# EAGLE design camera2 (EAGLE 6.4)
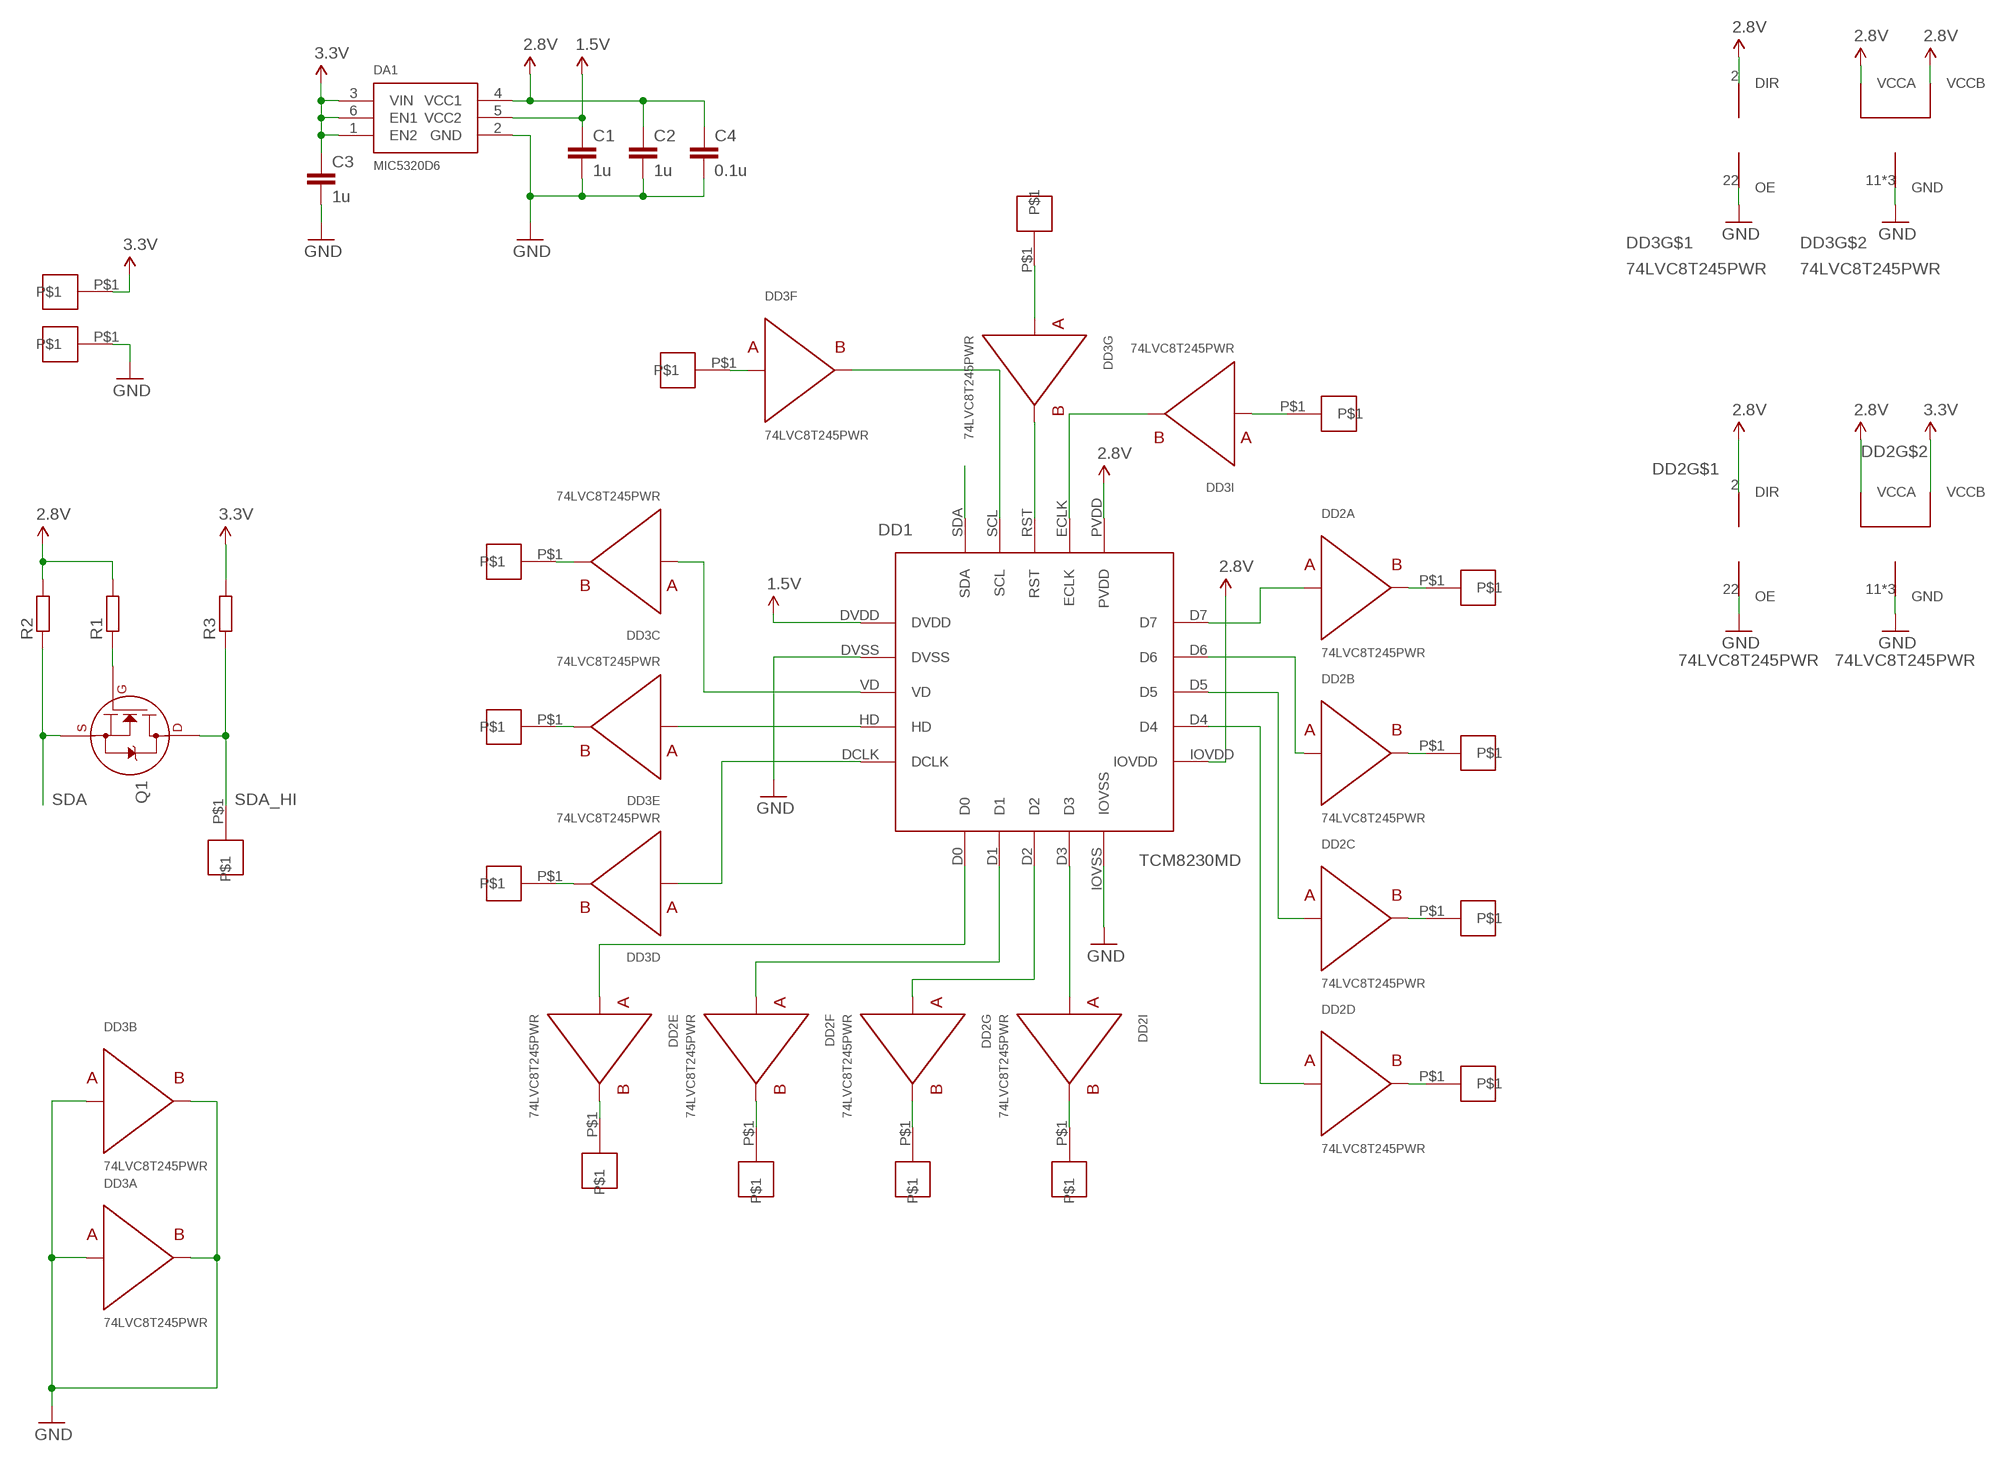
[diagram p0: schematic, sheet 1]

## Parts
C1  1u  C-EUC0603  [C0603]
C2  1u  C-EUC0603  [C0603]
C3  1u  C-EUC0603  [C0603]
C4  0.1u  C-EUC0603  [C0603]
DA1  MIC5320D6  [SOT23-6]
DD1  TCM8230MD  [TCM8230MD]
DD2  74LVC8T245PWR  [TSSOP24]
DD3  74LVC8T245PWR  [TSSOP24]
GND  HOLE  [HOLE]
Q1  2N7000_SOT23  [SOT-23]
R1  R-EU_R0603  [R0603]
R2  R-EU_R0603  [R0603]
R3  R-EU_R0603  [R0603]
SDAC  HOLE  [HOLE]
SDLC  HOLE  [HOLE]
U$27  HOLE  [HOLE]
U$30  HOLE  [HOLE]
U$31  HOLE  [HOLE]
U$32  HOLE  [HOLE]
U$33  HOLE  [HOLE]
U$34  HOLE  [HOLE]
U$35  HOLE  [HOLE]
U$36  HOLE  [HOLE]
U$37  HOLE  [HOLE]
U$38  HOLE  [HOLE]
U$39  HOLE  [HOLE]
U$40  HOLE  [HOLE]
U$41  HOLE  [HOLE]
VDD  HOLE  [HOLE]

## Nets
1.5V: C1.1 DA1.5(VCC2) DD1.DVDD
2.8V: C2.1 C4.1 DA1.4(VCC1) DD1.IOVDD DD1.PVDD DD2.1(VCCA) DD2.2(DIR) DD3.1(VCCA) DD3.2(DIR) DD3.23(VCCB) DD3.24(VCCB) R1.2 R2.2
3.3V: C3.1 DA1.1(EN2) DA1.3(VIN) DA1.6(EN1) DD2.23(VCCB) DD2.24(VCCB) R3.2 VDD.P$1
D0_O: DD2.17(E:B1) U$32.P$1
D1_O: DD2.16(F:B1) U$31.P$1
D2_O: DD2.15(G:B1) U$30.P$1
D3_O: DD2.14(I:B1) U$27.P$1
D4_O: DD2.18(D:B1) U$36.P$1
D5_O: DD2.19(C:B1) U$35.P$1
D6_O: DD2.20(B:B1) U$34.P$1
D7_O: DD2.21(A:B1) U$33.P$1
DCLK_O: DD3.18(D:B1) U$39.P$1
ECLK: DD1.ECLK DD3.14(I:B1)
ECLK_O: DD3.10(I:A1) U$41.P$1
GND: C1.2 C2.2 C3.2 C4.2 DA1.2(GND) DD1.DVSS DD1.IOVSS DD2.11(GND) DD2.12(GND) DD2.13(GND) DD2.22(OE) DD3.3(A:A1) DD3.4(B:A1) DD3.11(GND) DD3.12(GND) DD3.13(GND) DD3.20(B:B1) DD3.21(A:B1) DD3.22(OE) GND.P$1
HD_O: DD3.17(E:B1) U$38.P$1
N$1: DD1.D3 DD2.10(I:A1)
N$2: DD1.D7 DD2.3(A:A1)
N$3: DD1.D6 DD2.4(B:A1)
N$4: DD1.D5 DD2.5(C:A1)
N$5: DD1.D4 DD2.6(D:A1)
N$6: DD1.D0 DD2.7(E:A1)
N$7: DD1.D2 DD2.9(G:A1)
N$9: DD1.D1 DD2.8(F:A1)
N$10: DD1.VD DD3.5(C:A1)
N$11: DD1.HD DD3.7(E:A1)
N$12: Q1.1(G) R1.1
N$13: DD1.DCLK DD3.6(D:A1)
N$18: DD1.RST DD3.15(G:B1)
RST_O: DD3.9(G:A1) U$40.P$1
SDA: DD1.SDA Q1.2(S) R2.1
SDA_HI: Q1.3(D) R3.1 SDAC.P$1
SDL: DD1.SCL DD3.16(F:B1)
SDL_IN: DD3.8(F:A1) SDLC.P$1
VD_O: DD3.19(C:B1) U$37.P$1

## Library data of the parts
C1-C4 = rcl:C-EU: CAPACITOR, European symbol
DA1 = ezlib:MIC5320: Dual ULDO from MICREL
DD1 = ezlib:TCM8230: The TCM8230MD(A) is a camera module which includes area color image sensor embedded with camera signal processor that meets with VGA format. In the sensor area 492 vertical and 660 horizontal signal pixels, and the image size meets with 1/6 inch optical Format. Use of the CMOS process enables low power consumption operations. It also provides excellent color reproduction through its primary color filter, and embedded camera signal processor enables small and simple camera system. And this module can be assembled by the socket which is suitable for the reflow soldering. So it is fit to use as an image input device for digital still cameras, PC cameras and mobile devices.
DD2 DD3 = ezlib:74LVC8T245
GND SDAC SDLC U$27 U$30-U$41 VDD = ezlib:HOLE
Q1 = transistors:2N700*: 2N7000, 2N7002, NDS7002A N-channel enhancement mode MOSFET
R1-R3 = rcl:R-EU_: RESISTOR, European symbol

## Board
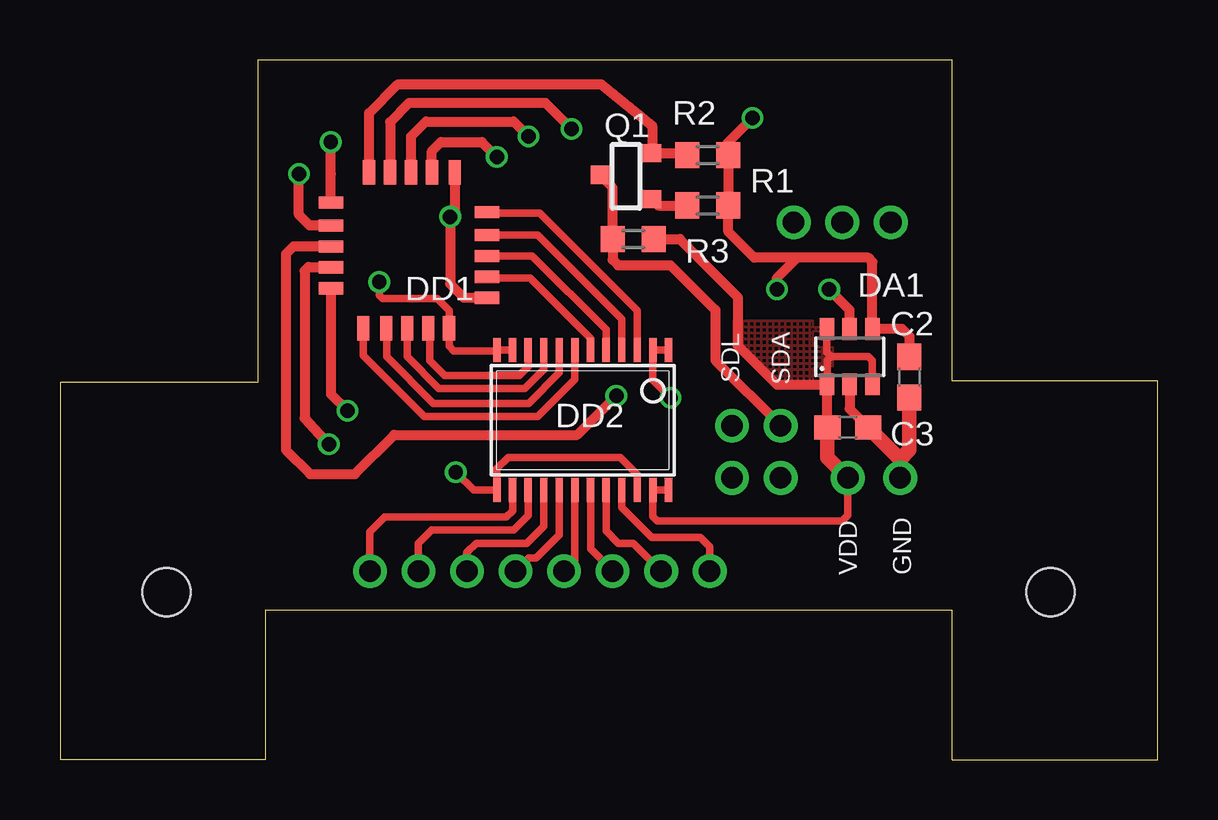
[diagram p1: board, top side]
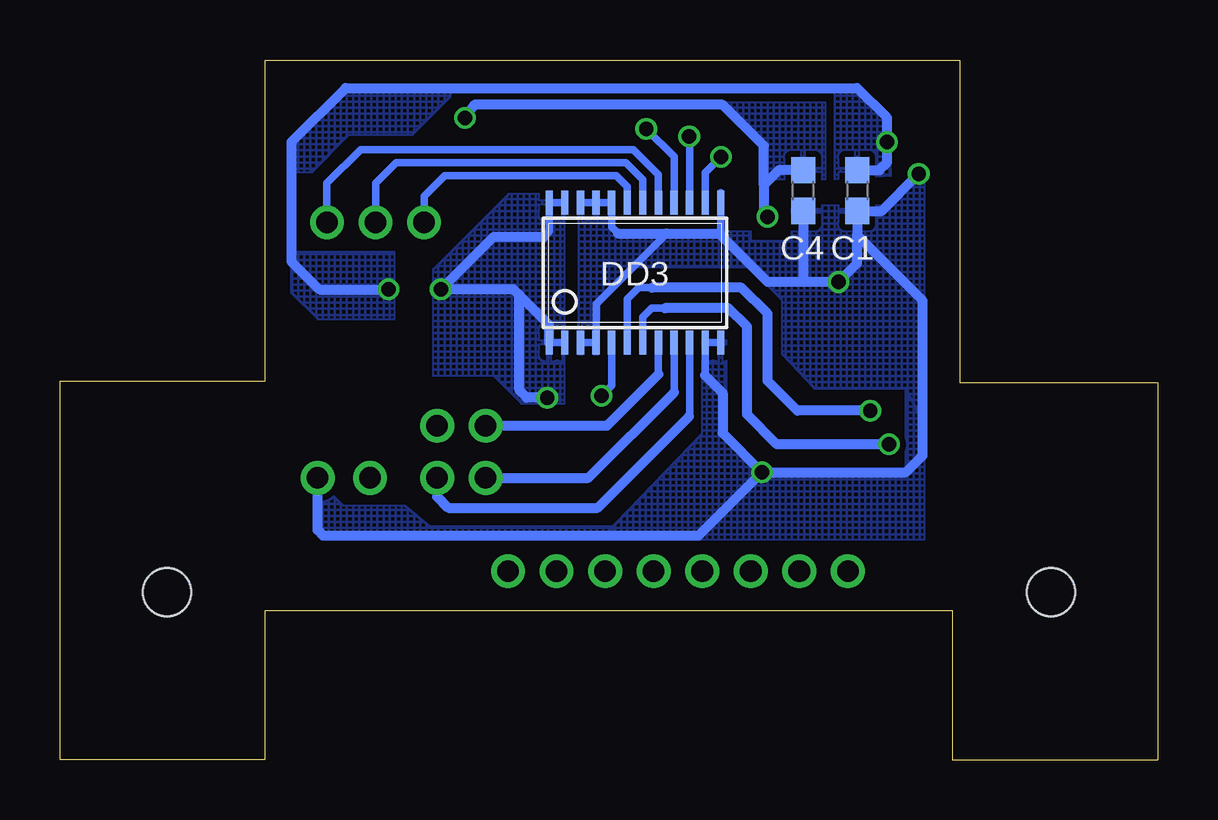
[diagram p2: board, bottom side, seen from below]

Size 45.74 x 29.17 mm. Coordinates in mm from the lower left corner, seen from the top.
Outline: 0,15.71 0,0 8.56,0 8.56,6.22 37.18,6.22 37.18,0 45.74,0 45.74,15.79 37.18,15.79 37.18,29.17 8.24,29.17 8.24,15.71 0,15.71
Copper layers (1*16): Top 0.035mm / dielectric 1.5mm / Bottom 0.035mm
Design rules "Fusion_eagle_rule_v1.1": minimum track width 6mil, minimum drill 12mil, track to track 6mil, track to pad 6mil, pad to pad 6mil, via to via 6mil, smd to smd 0mil, copper to edge 10mil, drill to drill 10mil, minimum pad ring 10mil, minimum via ring 6mil, stop-mask expansion 2mil, vias tented up to drill 100mil, thermal gap 10mil
Holes 2 mm at 4.45,6.99 41.27,6.99

### Footprints (pad centres in the part's own frame; a part is rotated, then mirrored left to right if it is on the bottom)
C0603 = smd 1.1 x 1: 1 -0.85,0; 2 0.85,0
SOT23-6 = smd 0.6 x 0.9: 1 -0.95,-1.15; 2 0,-1.15; 3 0.95,-1.15; 4 0.95,1.15; 5 0,1.15; 6 -0.95,1.15
TCM8230MD = smd 0.508 x 1.016: D0 -1.984,-3.254; D1 -1.032,-3.254; D2 -0.159,-3.254; D3 0.714,-3.254; ECLK 0.873,3.254; IOVSS 1.587,-3.254; PVDD 1.826,3.254; RST 0,3.254; SCL -0.873,3.254; SDA -1.746,3.254 | smd 1.016 x 0.508: D4 3.175,-1.111; D5 3.175,-0.238; D6 3.175,0.635; D7 3.175,1.587; DCLK -3.334,-1.587; DVDD -3.334,1.984; DVSS -3.334,1.032; HD -3.334,-0.714; IOVDD 3.175,-1.984; VD -3.334,0.159
TSSOP24 = smd 0.305 x 0.991: 1 -3.575,-2.918; 2 -2.925,-2.918; 3 -2.275,-2.918; 4 -1.625,-2.918; 5 -0.975,-2.918; 6 -0.325,-2.918; 7 0.325,-2.918; 8 0.975,-2.918; 9 1.625,-2.918; 10 2.275,-2.918; 11 2.925,-2.918; 12 3.575,-2.918; 13 3.575,2.918; 14 2.925,2.918; 15 2.275,2.918; 16 1.625,2.918; 17 0.975,2.918; 18 0.325,2.918; 19 -0.325,2.918; 20 -0.975,2.918; 21 -1.625,2.918; 22 -2.275,2.918; 23 -2.925,2.918; 24 -3.575,2.918
HOLE = drill 0.9: P$1 0,0
SOT-23 = smd 0.762 x 0.762: 1 -0.979,-1.101; 2 0.94,-1.101; 3 0.025,1.067
R0603 = smd 1 x 1.1: 1 -0.85,0; 2 0.85,0

### Placement (x,y rotation side)
C1  12.52,23.73 270 bottom
C2  35.39,15.95 270 top
C3  32.83,13.85 0 top
C4  14.78,23.73 270 bottom
DA1  32.9,16.8 0 top
DD1  14.62,21.24 0 top
DD2  21.78,14.16 180 top
DD3  21.78,20.3 0 bottom
GND  35,11.75 0 top
Q1  23.57,24.35 90 top
R1  26.99,23.1 0 top
R2  26.99,25.2 0 top
R3  23.88,21.7 0 top
SDAC  30.03,13.92 0 top
SDLC  28,13.92 0 top
U$27  12.91,7.86 270 top
U$30  14.94,7.86 270 top
U$31  16.96,7.86 90 top
U$32  18.98,7.86 90 top
U$33  27.07,7.86 270 top
U$34  25.05,7.86 270 top
U$35  23.03,7.86 270 top
U$36  21,7.86 270 top
U$37  30.57,22.4 0 top
U$38  34.62,22.4 0 top
U$39  32.59,22.4 0 top
U$40  28,11.75 0 top
U$41  30.03,11.75 0 top
VDD  32.83,11.75 0 top

### Tracks (layer width: path | path; a pad name or v marks a point on that pad's centre or on a via)
1.5V  (via drill 0.6)
  Top 0.406: DD1.DVDD 11.29,24.41 v11.28,25.75 | DA1.5 32.9,18.75 v32.05,19.6
  Bottom 0.406: v32.05,19.6 34.93,19.6 36.09,20.77 36.09,25.75 33.84,28 12.52,28 11.28,26.76 v11.28,25.75 11.28,24.89 11.6,24.57 C1.1
  pour Bottom (isolate 0.254, hatched): 31.82,21.16 36.09,21.16 36.09,19.45 35,18.36 31.82,18.36
  pour Bottom (isolate 0.254, hatched): 29.48,28 33.99,28 36.17,25.83 36.17,24.5 35.24,24.5 33.68,26.06 31.04,26.06 29.48,27.61
  pour Bottom (isolate 0.254, hatched): 13.46,24.19 11.12,24.35 11.2,26.76 12.45,28 13.46,28
2.8V  (via drill 0.6)
  Top 0.305: DD2.1 DD2.2 24.71,15.82 v25.44,15.09
  Top 0.406: 16.49,24.45 DD1.PVDD 16.45,22.83 v16.26,22.64 16.26,19.84 16.84,19.25 DD1.IOVDD | C2.1 35.39,17.66 35.08,17.97 33.87,17.97 DA1.4 33.85,20.75 33.68,20.93 30.73,20.93 | 30.73,20.93 28.94,20.93 27.85,22.01 R1.2 R2.2 27.84,25.74 v28.86,26.76 | v29.87,19.6 29.87,20.07 30.73,20.93
  Bottom 0.305: DD3.1 DD3.2 | DD3.23 DD3.24 25.36,22.02 25.59,21.78
  Bottom 0.406: v25.44,15.09 26.29,15.09 26.6,15.4 26.6,19.37 | v28.86,26.76 28.47,27.3 18.12,27.3 16.41,25.59 16.41,23.96 | 25.59,21.78 27.69,21.78 v29.87,19.6 26.84,19.6 26.6,19.37 | DD3.1 25.36,18.12 26.6,19.37 | C4.1 15.8,24.57 16.41,23.96 | 16.41,23.96 16.41,22.79 v16.26,22.64
  pour Bottom (isolate 0.254, hatched): 24.74,23.65 24.74,14.86 26.53,14.86 27.69,16.02 30.18,16.02 30.18,20.46 27.07,23.57 24.81,23.57
  pour Bottom (isolate 0.254, hatched): 18.2,27.38 13.85,27.38 13.85,24.19 16.57,24.19 16.57,25.51 18.2,27.15
3.3V
  Top 0.305: DD2.24 DD2.23 24.71,10.14 24.89,9.96 32.59,9.96 32.83,10.19 VDD.P$1 | DA1.3 33.85,16.63 33.68,16.8 32.13,16.8 | 32.13,16.8 31.97,16.65 31.97,15.67 DA1.1 | DA1.6 31.95,16.97 32.13,16.8
  Top 0.406: C3.1 31.95,13.87 DA1.1 31.94,15.63 29.87,15.63 28.24,17.27 28.24,19.29 25.82,21.7 R3.2
  Top 0.61: VDD.P$1 31.98,12.6 C3.1
  pour Top (isolate 0.254, hatched): 32.2,18.28 32.2,15.48 29.87,15.48 28.08,17.27 28.08,18.28
D0_O
  Top 0.305: DD2.17 20.8,9.37 19.84,8.4 19.52,8.4 U$32.P$1
D1_O
  Top 0.305: DD2.16 20.16,9.73 19.45,9.02 17.35,9.02 16.96,8.63 U$31.P$1
D2_O
  Top 0.305: DD2.15 19.51,10.17 18.9,9.57 15.48,9.57 14.94,9.02 U$30.P$1
D3_O
  Top 0.305: DD2.14 18.86,10.38 18.59,10.11 13.54,10.11 12.91,9.49 U$27.P$1
D4_O
  Top 0.305: DD2.18 21.46,8.31 U$36.P$1
D5_O
  Top 0.305: DD2.19 22.11,8.78 U$35.P$1
D6_O
  Top 0.305: DD2.20 22.76,9.53 23.26,9.02 23.88,9.02 U$34.P$1
D7_O
  Top 0.305: DD2.21 23.41,10.51 24.66,9.26 26.68,9.26 27.07,8.87 U$33.P$1
DCLK_O
  Bottom 0.305: DD3.18 21.46,24.18 22.17,24.89 31.74,24.89 32.59,24.04 U$39.P$1
ECLK  (via drill 0.6)
  Top 0.406: DD1.ECLK 15.5,25.38 15.87,25.75 17.58,25.75 v18.2,25.12
  Bottom 0.305: DD3.14 18.86,24.47 v18.2,25.12
ECLK_O
  Bottom 0.305: DD3.10 19.51,14.33 19.52,14.31
  Bottom 0.406: 19.52,14.31 23.34,10.5 29.56,10.5 30.03,10.97 U$41.P$1
GND  (via drill 0.6)
  Top 0.305: 11.31,22.25 DD1.DVSS | DD2.11 DD2.12 18.17,17.04 16.41,17.04 16.21,17.24 DD1.IOVSS 16.21,18.71 15.71,19.21 13.46,19.21 13.3,19.37 v13.3,19.91 | v16.49,11.98 17.23,11.24 DD2.13 18.2,12.13 18.67,12.6 23.34,12.6 24.05,11.88 DD2.22
  Top 0.406: DD1.IOVSS 16.21,17.78 | 11.35,22.32 DD1.DVSS 10.4,22.27 9.96,22.71 v9.96,24.43 | C3.2 32.9,14.62 DA1.2
  Top 0.61: GND.P$1 35,12.52 | 35,12.52 C3.2 | C2.2 35.39,12.91 35,12.52
  Bottom 0.305: DD3.12 DD3.11 18.86,16.02 | 18.21,23.64 DD3.13 18.21,22.01 18.28,21.94 | DD3.3 DD3.4 23.41,18.99 20.46,21.94 | DD3.22 DD3.21 DD3.20 22.76,22.21 22.48,21.94
  Bottom 0.406: v9.96,24.43 11.51,22.88 C1.2 12.52,21.86 | 22.48,21.94 20.46,21.94 18.28,21.94 16.26,19.91 14.78,19.91 | 18.86,16.02 18.12,15.29 18.12,13.61 v16.49,11.98 | v16.49,11.98 19.14,9.34 34.77,9.34 35,9.57 GND.P$1 | v16.49,11.98 10.5,11.98 9.8,12.68 9.8,19.14 12.52,21.86 | 12.52,21.86 12.52,20.69 v13.3,19.91 14.78,19.91 | C4.2 14.78,19.91
  pour Bottom (isolate 0.254, hatched): 10.5,15.48 14.31,15.48 15.64,16.88 15.64,19.14 17.04,20.54 21.94,20.54 23.26,19.21 23.34,16.88 24.11,16.88 24.11,23.65 22.64,23.65 22.64,22.01 16.96,22.01 16.96,21.62 15.25,21.62 15.25,23.1 11.51,23.1 10.11,24.5 9.72,24.27 9.72,13.92
  pour Bottom (isolate 0.254, hatched): 23.1,9.33 18.98,13.61 18.98,17.74 17.97,17.74 17.97,13.69 16.65,12.13 10.5,12.13 10.5,15.48 9.72,14 9.72,9.18 23.1,9.18
  pour Bottom (isolate 0.254, hatched): 22.71,9.72 30.34,9.72 31.35,10.58 33.92,10.58 35,11.67 35,9.57 34.3,9.18 22.71,9.18
HD_O
  Bottom 0.305: DD3.17 20.8,24.38 21.86,25.44 33.22,25.44 34.62,24.04 U$38.P$1
N$1
  Top 0.305: DD1.D3 15.4,17.92 15.4,16.65 16.02,16.02 19.14,16.02 19.51,16.39 DD2.10
N$2
  Top 0.305: DD2.3 24.05,18.73 19.99,22.79 17.83,22.79 DD1.D7
N$3
  Top 0.305: DD2.4 23.41,18.37 19.91,21.86 17.81,21.86 DD1.D6
N$4
  Top 0.305: DD2.5 22.76,17.93 19.68,21 DD1.D5
N$5
  Top 0.305: DD2.6 22.11,17.57 19.6,20.07 17.86,20.07 DD1.D4
N$6
  Top 0.305: DD2.7 21.46,15.86 19.91,14.31 15.17,14.31 12.64,16.84 DD1.D0
N$7
  Top 0.305: DD2.9 20.16,16.27 19.37,15.48 15.79,15.48 14.47,16.8 DD1.D2
N$9
  Top 0.305: DD2.8 20.8,16.14 19.52,14.86 15.56,14.86 13.61,16.8 13.61,17.96 DD1.D1
N$10  (via drill 0.6)
  Top 0.406: DD1.VD 9.73,21.39 9.41,21.08 9.41,12.91 10.42,11.9 12.29,11.9 13.92,13.54 21.55,13.54 v23.18,15.17
  Bottom 0.305: v23.18,15.17 22.76,15.59 DD3.5
N$11  (via drill 0.6)
  Top 0.406: v11.2,13.15 10.19,14.23 10.19,20.38 10.35,20.54 11.28,20.54 DD1.HD
  Bottom 0.305: DD3.7 21.46,18.45 21.08,18.82 20.54,18.82
  Bottom 0.406: v11.2,13.15 15.87,13.15 17.11,14.39 17.11,18.05 17.89,18.82 20.54,18.82
N$12
  Top 0.406: Q1.1 24.92,23.1 R1.1
N$13  (via drill 0.6)
  Top 0.406: DD1.DCLK 11.29,15.23 v11.98,14.55
  Bottom 0.305: DD3.6 22.11,19.2 21.62,19.68 21.08,19.68
  Bottom 0.406: v11.98,14.55 15.01,14.55 16.26,15.79 16.26,18.59 17.35,19.68 21.08,19.68
N$18  (via drill 0.6)
  Top 0.406: DD1.RST 14.62,25.98 15.25,26.6 18.9,26.6 v19.52,25.98
  Bottom 0.305: DD3.15 19.51,25.96 v19.52,25.98
RST_O
  Bottom 0.305: DD3.9 20.16,15.32
  Bottom 0.406: U$40.P$1 23.73,11.75 20.16,15.32
SDA
  Top 0.406: DD1.SDA 12.88,26.96 14.08,28.16 22.56,28.16 24.67,26.43 Q1.2 26.2,25.29 R2.1
SDA_HI
  Top 0.406: Q1.3 23.03,23.84 R3.1 23.03,20.84 23.26,20.61 25.44,20.61 27.3,18.75 27.3,16.65 SDAC.P$1
SDL  (via drill 0.6)
  Top 0.406: v21.31,26.29 20.23,27.38 14.55,27.38 13.75,26.59 DD1.SCL
  Bottom 0.305: DD3.16 20.16,25.13 v21.31,26.29
SDL_IN
  Bottom 0.305: DD3.8 20.8,16.07
  Bottom 0.406: SDLC.P$1 22.95,13.92 20.8,16.07
VD_O
  Bottom 0.305: DD3.19 22.11,23.89 22.56,24.35 29.71,24.35 30.57,23.49 U$37.P$1

### Text on the board
tNames: SDL | SDA | VDD | GND